# Altium schematic sheet PI_CON.SchDoc
size B; SheetNumber: 4; SheetTotal: 4
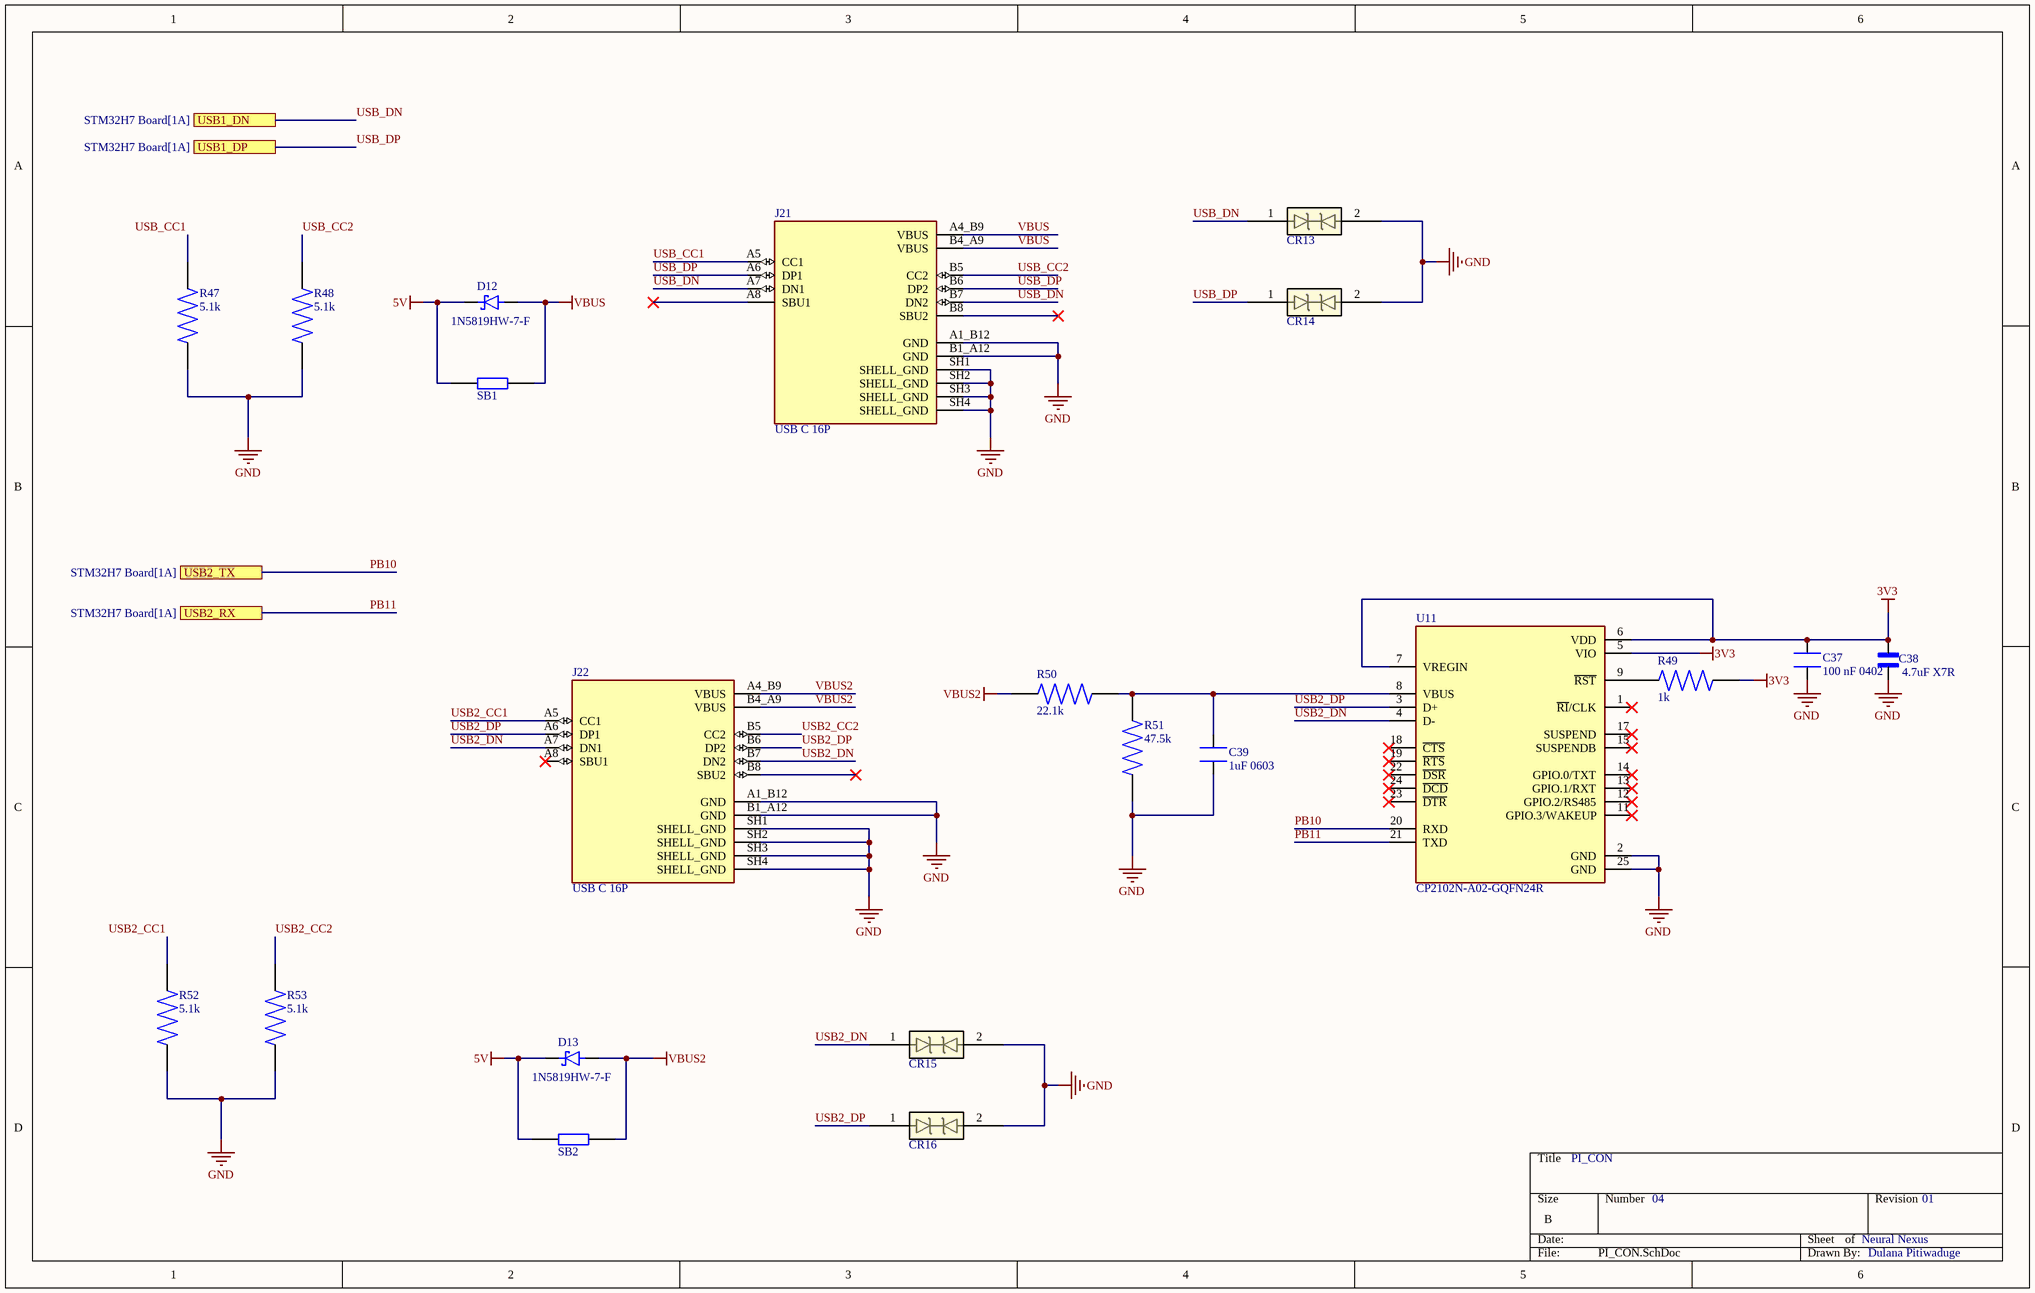
[diagram p0: PI_CON.SchDoc]

## Parts
C37  100 nF 0402  [CAPC1005X55N]
C38  4.7uF X7R  [CAPC2012X145N]
C39  1uF 0603  [CAPC1608X90]
CR13  SP0402B-ULC-01ETG  [SP0402_LTF]  (value not drawn)
CR14  SP0402B-ULC-01ETG  [SP0402_LTF]  (value not drawn)
CR15  SP0402B-ULC-01ETG  [SP0402_LTF]  (value not drawn)
CR16  SP0402B-ULC-01ETG  [SP0402_LTF]  (value not drawn)
D12  1N5819HW-7-F  [SOD3715X145N]
D13  1N5819HW-7-F  [SOD3715X145N]
J21  USB C 16P  [GCT_USB4105-GF-A]
J22  USB C 16P  [GCT_USB4105-GF-A]
R47  5.1k  [RESC1005X35N]
R48  5.1k  [RESC1005X35N]
R49  1k  [RESC1005X40N]
R50  22.1k  [RESC1508X55N]
R51  47.5k  [RESC1005X40N]
R52  5.1k  [RESC1005X35N]
R53  5.1k  [RESC1005X35N]
SB1  0R  [RESC1608X55N]  (value not drawn)
SB2  0R  [RESC1608X55N]  (value not drawn)
U11  CP2102N-A02-GQFN24R  [QFN50P400X400X80-25N]

## Ports
USB1_DN (see STM32H7 Board[1A]), USB1_DP (see STM32H7 Board[1A]), USB2_RX (see STM32H7 Board[1A]), USB2_TX (see STM32H7 Board[1A])

## Nets
3V3: C37.2 C38.2 R49.2 U11.5(VIO) U11.6(VDD) U11.7(VREGIN)
5V: D12.C(K) D13.C(K) SB1.1 SB2.1
GND: C37.1 C38.1 C39.2 CR13.2 CR14.2 CR15.2 CR16.2 J21.A1_B12(GND) J21.B1_A12(GND) J21.SH1(SHELL_GND) J21.SH2(SHELL_GND) J21.SH3(SHELL_GND) J21.SH4(SHELL_GND) J22.A1_B12(GND) J22.B1_A12(GND) J22.SH1(SHELL_GND) J22.SH2(SHELL_GND) J22.SH3(SHELL_GND) J22.SH4(SHELL_GND) R47.2 R48.2 R51.1 R52.2 R53.2 U11.2(GND) U11.25(GND)
VBUS: D12.A J21.A4_B9(VBUS) J21.B4_A9(VBUS) SB1.2
VBUS2: D13.A J22.A4_B9(VBUS) J22.B4_A9(VBUS) R50.1 SB2.2
PB10: U11.20(RXD) ; port USB2_TX
PB11: U11.21(TXD) ; port USB2_RX
USB2_CC1: J22.A5(CC1) R52.1
USB2_CC2: J22.B5(CC2) R53.1
USB2_DN: CR15.1 J22.A7(DN1) J22.B7(DN2) U11.4(D-)
USB2_DP: CR16.1 J22.A6(DP1) J22.B6(DP2) U11.3(D+)
USB_CC1: J21.A5(CC1) R47.1
USB_CC2: J21.B5(CC2) R48.1
USB_DN: CR13.1 J21.A7(DN1) J21.B7(DN2) ; port USB1_DN
USB_DP: CR14.1 J21.A6(DP1) J21.B6(DP2) ; port USB1_DP
NetC39_1: C39.1 R50.2 R51.2 U11.8(VBUS)
NetR49_1: R49.1 U11.9(~{RST})

Not connected (* = marked no-connect by the designer): J21 A8(SBU1)* B8(SBU2)*; J22 A8(SBU1)* B8(SBU2)*; U11 1(~{RI}/CLK)* 11(GPIO.3/WAKEUP)* 12(GPIO.2/RS485)* 13(GPIO.1/RXT)* 14(GPIO.0/TXT)* 15(SUSPENDB)* 17(SUSPEND)* 18(~{CTS})* 19(~{RTS})* 22(~{DSR})* 23(~{DTR})* 24(~{DCD})*

## Notes on the sheet
- PI_CON
- 04
- Neural Nexus
- 01
- Dulana Pitiwaduge

## Library data of the parts
C37 = CL05B104KP5NNNC: 0.1 ÂµF Â±10% 10V Ceramic Capacitor X7R 0402 (1005 Metric); MF: Samsung Electro-Mechanics; SnapEDA_Link: https://www.snapeda.com/parts/CL05B104KP5NNNC/Samsung/view-part/?ref=snap; Package: SMD-2 Samsung; Value: *; MP: CL05B104KP5NNNC; Check_prices: https://www.snapeda.com/parts/CL05B104KP5NNNC/Samsung/view-part/?ref=eda
C38 = C2012X7R1A475K125AC: C Series 0805 4.7 uF 10 V Â±10% Tolerance X7R SMT Multilayer Ceramic Capacitor; MF: TDK; Check_prices: https://www.snapeda.com/parts/C2012X7R1A475K125AC/TDK-Lambda+Americas+Inc/view-part/?ref=eda; Purchase-URL: https://pricing.snapeda.com/search/part/C2012X7R1A475K125AC/?ref=eda; Value: *; Availability: In Stock; Price: None; Package: 2012 TDK; MP: C2012X7R1A475K125AC; SnapEDA_Link: https://www.snapeda.com/parts/C2012X7R1A475K125AC/TDK-Lambda+Americas+Inc/view-part/?ref=snap
C39 = CC0603ZRY5V7BB105: 1 ÂµF -20%, +80% 16V Ceramic Capacitor Y5V (F) 0603 (1608 Metric); MF: Yageo; SnapEDA_Link: https://www.snapeda.com/parts/CC0603ZRY5V7BB105/Yageo/view-part/?ref=snap; Package: 0603 Yageo; Value: *; MP: CC0603ZRY5V7BB105; Check_prices: https://www.snapeda.com/parts/CC0603ZRY5V7BB105/Yageo/view-part/?ref=eda
CR13-CR16 = SP0402B-ULC-01ETG: Description; Manufacturer_Name: Littelfuse Inc; Copyright: Copyright (C) 2025 Ultra Librarian. All rights reserved.; Manufacturer_Part_Number: SP0402B-ULC-01ETG; RefDes: RefDes; Type: Type
D12 D13 = 1N5819HW-7-F: Diode Schottky 40 V 1A Surface Mount SOD-123; MF: Diodes Inc.; Value: *; SnapEDA_Link: https://www.snapeda.com/parts/1N5819HW-7-F/Diodes+Inc./view-part/?ref=snap; Purchase-URL: https://pricing.snapeda.com/search/part/1N5819HW-7-F/?ref=eda; Availability: In Stock; Price: None; Package: SOD-123 Fairchild Semiconductor; Check_prices: https://www.snapeda.com/parts/1N5819HW-7-F/Diodes+Inc./view-part/?ref=eda; MP: 1N5819HW-7-F
J21 J22 = USB4105-GF-A: CONN RCP USB2.0 TYP C 16P SMD RA; MF: {'manufacturer': u'GCT'}; Package: None; Price: None; Value: *; MP: USB4105-GF-A; Availability: Unavailable
  J22: LCSC Part Number: C5184243
R47 R48 R52 R53 = RMCF0402FT5K10: 5.1 kOhms Â±1% 0.063W, 1/16W Chip Resistor 0402 (1005 Metric) Automotive AEC-Q200 Thick Film; MF: Stackpole Electronics Inc; SnapEDA_Link: https://www.snapeda.com/parts/RMCF0402FT5K10/Stackpole+Electronics/view-part/?ref=snap; Package: 1005 Stackpole; Value: *; MP: RMCF0402FT5K10; Check_prices: https://www.snapeda.com/parts/RMCF0402FT5K10/Stackpole+Electronics/view-part/?ref=eda
R49 = RC0402FR-071KL: 1 kOhms Â±1% 0.063W, 1/16W Chip Resistor 0402 (1005 Metric) Moisture Resistant Thick Film; MF: Yageo Corporation; MP: RC0402FR071KL; SnapEDA_Link: https://www.snapeda.com/parts/RC0402FR071KL/Yageo/view-part/?ref=snap; Package: 0402-2 YAGEO; Value: *; Check_prices: https://www.snapeda.com/parts/RC0402FR071KL/Yageo/view-part/?ref=eda
R50 = RMCF0603FT22K1: 22.1 kOhms Â±1% 0.1W, 1/10W Chip Resistor 0603 (1608 Metric) Automotive AEC-Q200 Thick Film; MF: Stackpole Electronics Inc; SnapEDA_Link: https://www.snapeda.com/parts/RMCF0603FT22K1/Stackpole+Electronics/view-part/?ref=snap; Package: 1508 Stackpole; Value: *; MP: RMCF0603FT22K1; Check_prices: https://www.snapeda.com/parts/RMCF0603FT22K1/Stackpole+Electronics/view-part/?ref=eda
R51 = RC0402FR-0747K5L: 47.5 kOhms Â±1% 0.063W, 1/16W Chip Resistor 0402 (1005 Metric) Moisture Resistant Thick Film; MF: Yageo; SnapEDA_Link: https://www.snapeda.com/parts/RC0402FR-0747K5L/Yageo/view-part/?ref=snap; Package: 1005 Panasonic Electronic Components; Value: *; MP: RC0402FR-0747K5L; Check_prices: https://www.snapeda.com/parts/RC0402FR-0747K5L/Yageo/view-part/?ref=eda
SB1 SB2 = CR0603AJ/-000EAS: Resistor, AS 0603 0R Jumper 100mW, AEC-Q, Anti-Sulur | Bourns CR0603AJ/-000EAS; MF: Bourns Inc.; SnapEDA_Link: https://www.snapeda.com/parts/CR0603AJ/-000EAS/Bourns/view-part/?ref=snap; Package: 0603-2 Bourns; Value: *; MP: CR0603AJ/-000EAS; Check_prices: https://www.snapeda.com/parts/CR0603AJ/-000EAS/Bourns/view-part/?ref=eda
U11 = CP2102N-A02-GQFN24R: IC USB TO UART BRIDGE QFN24; Value: *; MP: CP2102N-A02-GQFN24R; Package: None; Availability: Unavailable; Price: None